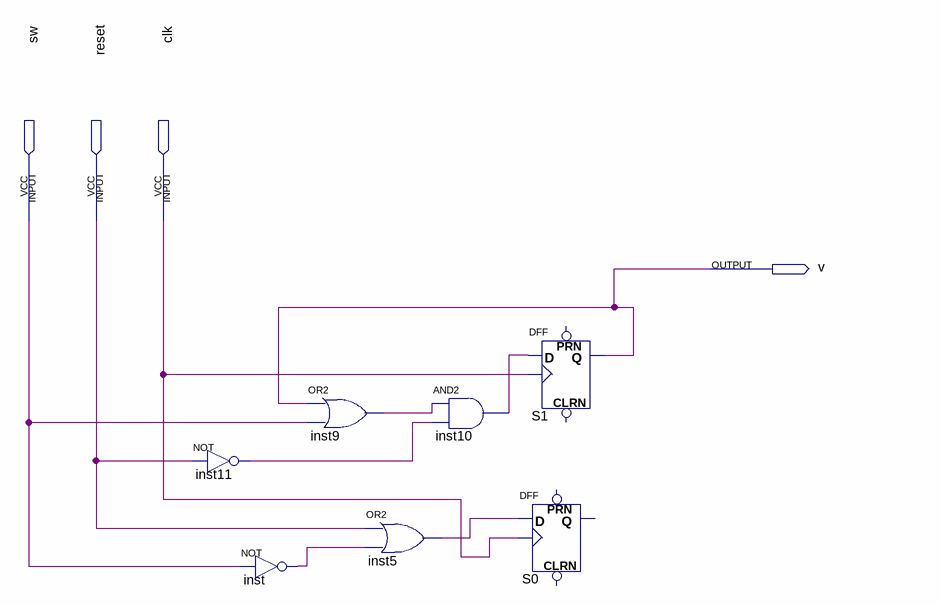
[diagram p0: schematic sheet]
// Quartus schematic sword.bdf as structural Verilog: 7 symbols, 4 pins
module sword (
  input  sw,
  input  reset,
  input  clk,
  output v
);

  wire inst5_out, inst9_out, inst10_out, inst11_out, inst_out;

  not inst11 (inst11_out, reset);
  not inst (inst_out, sw);
  or inst9 (inst9_out, v, sw);
  and inst10 (inst10_out, inst9_out, inst11_out);
  or inst5 (inst5_out, reset, inst_out);
  DFF S1 (.CLK(clk), .D(inst10_out), .Q(v));  // open: CLRN, PRN
  DFF S0 (.CLK(clk), .D(inst5_out));  // open: CLRN, PRN, Q
endmodule
